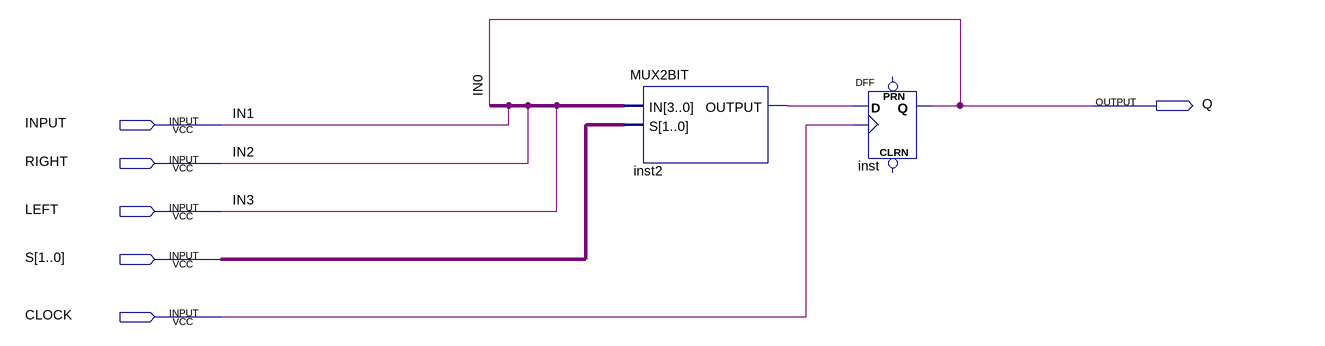
[diagram p0: schematic sheet]
// Quartus schematic ShiftRegiste1BIT.bdf as structural Verilog: 2 symbols, 6 pins
module ShiftRegiste1BIT (
  input  INPUT,
  input  RIGHT,
  input  LEFT,
  input  [1:0] S,
  input  CLOCK,
  output Q
);

  wire inst2_output;
  wire [3:0] undriven;

  MUX2BIT inst2 (.IN(undriven), .S(S), .OUTPUT(inst2_output));
  DFF inst (.CLK(CLOCK), .D(inst2_output), .Q(Q));  // open: CLRN, PRN

  // Other names for the same wires on the sheet: IN0 = Q; IN1 = INPUT; IN2 = RIGHT; IN3 = LEFT
endmodule
